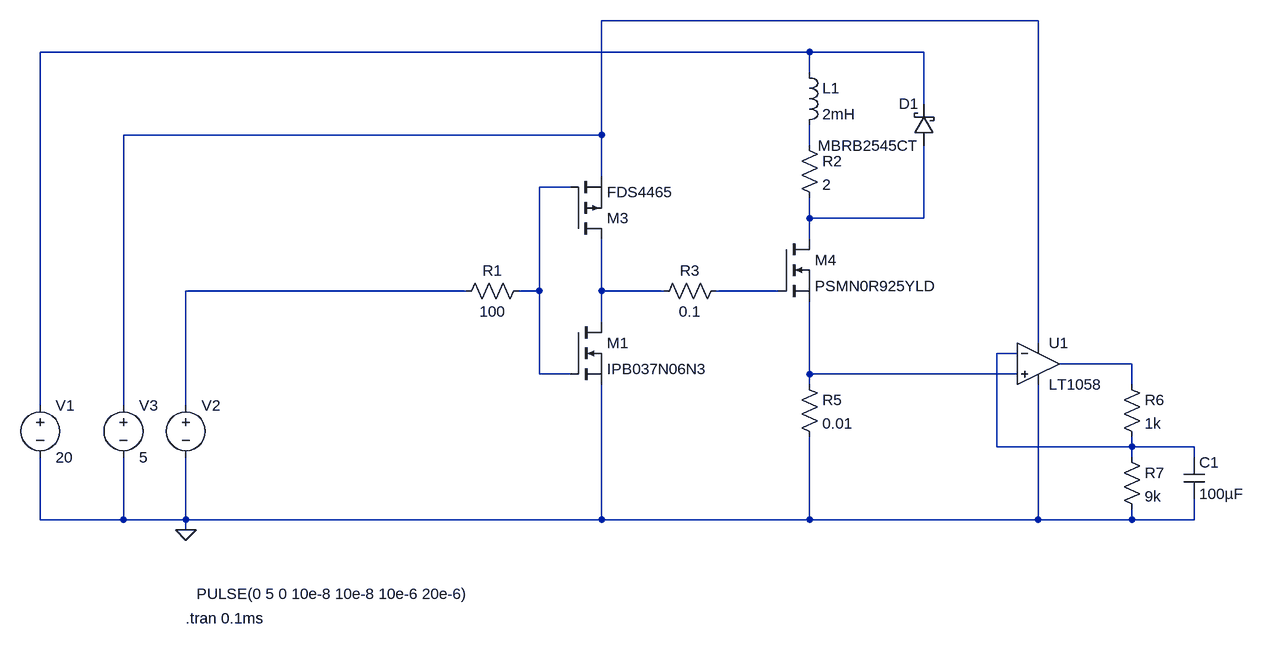
[diagram p0: schematic OpenDrainDriver.asc]
OpenDrainDriver.asc, the LTspice schematic file:
Version 4
SHEET 1 1588 680
WIRE 1264 -448 592 -448
WIRE 912 -400 -272 -400
WIRE 1088 -400 912 -400
WIRE 912 -368 912 -400
WIRE 1088 -320 1088 -400
WIRE 592 -272 592 -448
WIRE 592 -272 -144 -272
WIRE 912 -256 912 -288
WIRE 592 -208 592 -272
WIRE 544 -192 496 -192
WIRE 912 -144 912 -176
WIRE 1088 -144 1088 -256
WIRE 1088 -144 912 -144
WIRE 912 -112 912 -144
WIRE 384 -32 -48 -32
WIRE 496 -32 496 -192
WIRE 496 -32 464 -32
WIRE 592 -32 592 -112
WIRE 688 -32 592 -32
WIRE 864 -32 768 -32
WIRE 592 16 592 -32
WIRE 1264 48 1264 -448
WIRE 1232 64 1200 64
WIRE 1408 80 1296 80
WIRE 496 96 496 -32
WIRE 544 96 496 96
WIRE 912 96 912 -16
WIRE 1232 96 912 96
WIRE 912 112 912 96
WIRE 1408 112 1408 80
WIRE -272 144 -272 -400
WIRE -144 144 -144 -272
WIRE -48 144 -48 -32
WIRE 1200 208 1200 64
WIRE 1408 208 1408 192
WIRE 1408 208 1200 208
WIRE 1504 208 1408 208
WIRE 1408 224 1408 208
WIRE 1504 224 1504 208
WIRE -272 320 -272 224
WIRE -144 320 -144 224
WIRE -144 320 -272 320
WIRE -48 320 -48 224
WIRE -48 320 -144 320
WIRE 592 320 592 112
WIRE 592 320 -48 320
WIRE 912 320 912 192
WIRE 912 320 592 320
WIRE 1264 320 1264 112
WIRE 1264 320 912 320
WIRE 1408 320 1408 304
WIRE 1408 320 1264 320
WIRE 1504 320 1504 288
WIRE 1504 320 1408 320
WIRE -48 336 -48 320
FLAG -48 336 0
SYMBOL voltage -272 128 R0
WINDOW 123 0 0 Left 0
WINDOW 39 0 0 Left 0
SYMATTR InstName V1
SYMATTR Value 20
SYMBOL voltage -48 128 R0
WINDOW 3 17 306 Left 2
WINDOW 123 0 0 Left 0
WINDOW 39 0 0 Left 0
SYMATTR Value PULSE(0 5 0 10e-8 10e-8 10e-6 20e-6)
SYMATTR InstName V2
SYMBOL nmos 544 16 R0
SYMATTR InstName M1
SYMATTR Value IPB037N06N3
SYMBOL pmos 544 -112 M180
SYMATTR InstName M3
SYMATTR Value FDS4465
SYMBOL res 480 -48 R90
WINDOW 0 0 56 VBottom 2
WINDOW 3 32 56 VTop 2
SYMATTR InstName R1
SYMATTR Value 100
SYMBOL res 896 -272 R0
SYMATTR InstName R2
SYMATTR Value 2
SYMBOL ind 896 -384 R0
SYMATTR InstName L1
SYMATTR Value 2mH
SYMBOL voltage -144 128 R0
WINDOW 123 0 0 Left 0
WINDOW 39 0 0 Left 0
SYMATTR InstName V3
SYMATTR Value 5
SYMBOL nmos 864 -112 R0
SYMATTR InstName M4
SYMATTR Value PSMN0R925YLD
SYMBOL schottky 1104 -256 R180
WINDOW 0 24 64 Left 2
WINDOW 3 24 0 Left 2
SYMATTR InstName D1
SYMATTR Value MBRB2545CT
SYMATTR Description Diode
SYMATTR Type diode
SYMBOL res 896 96 R0
SYMATTR InstName R5
SYMATTR Value 0.01
SYMBOL Opamps\\LT1058 1264 16 R0
SYMATTR InstName U1
SYMBOL res 1392 96 R0
SYMATTR InstName R6
SYMATTR Value 1k
SYMBOL res 1392 208 R0
SYMATTR InstName R7
SYMATTR Value 9k
SYMBOL cap 1488 224 R0
SYMATTR InstName C1
SYMATTR Value 100µF
SYMBOL res 784 -48 R90
WINDOW 0 0 56 VBottom 2
WINDOW 3 32 56 VTop 2
SYMATTR InstName R3
SYMATTR Value 0.1
TEXT -48 472 Left 2 !.tran 0.1ms

The netlist it stands for:
* OpenDrainDriver.asc
V1 N002 0 20
V2 N006 0 PULSE(0 5 0 10e-8 10e-8 10e-6 20e-6)
M1 N007 N004 0 0 IPB037N06N3
M3 N007 N004 N001 N001 FDS4465
R1 N004 N006 100
R2 N003 N005 2
L1 N002 N003 2mH
V3 N001 0 5
M4 N005 N008 N011 N011 PSMN0R925YLD
D1 N005 N002 MBRB2545CT
R5 N011 0 0.01
XU1 N011 N009 N001 0 N010 LT1057  ; LT1058, pins In+ In- V+ V- OUT
R6 N010 N009 1k
R7 N009 0 9k
C1 N009 0 100µF
R3 N008 N007 0.1
.model D D
.lib standard.dio
.model NMOS NMOS
.model PMOS PMOS
.lib standard.mos
.tran 0.1ms
.lib LTC.lib
.backanno
.end